# EasyEDA Pro project ProProject_XIAO_NRF52833_2024-01-15.epro, schematic Schematic1
Create Date: 2023-08-24; Page Name: P1; Project Name: XIAO_NRF52833; Schematic Name: Schematic1; Update Date: 2023-10-26; Drawed: Stephen Long Jr; Page Size: A4; Part Number: XIAO833_001; Version: V1.0
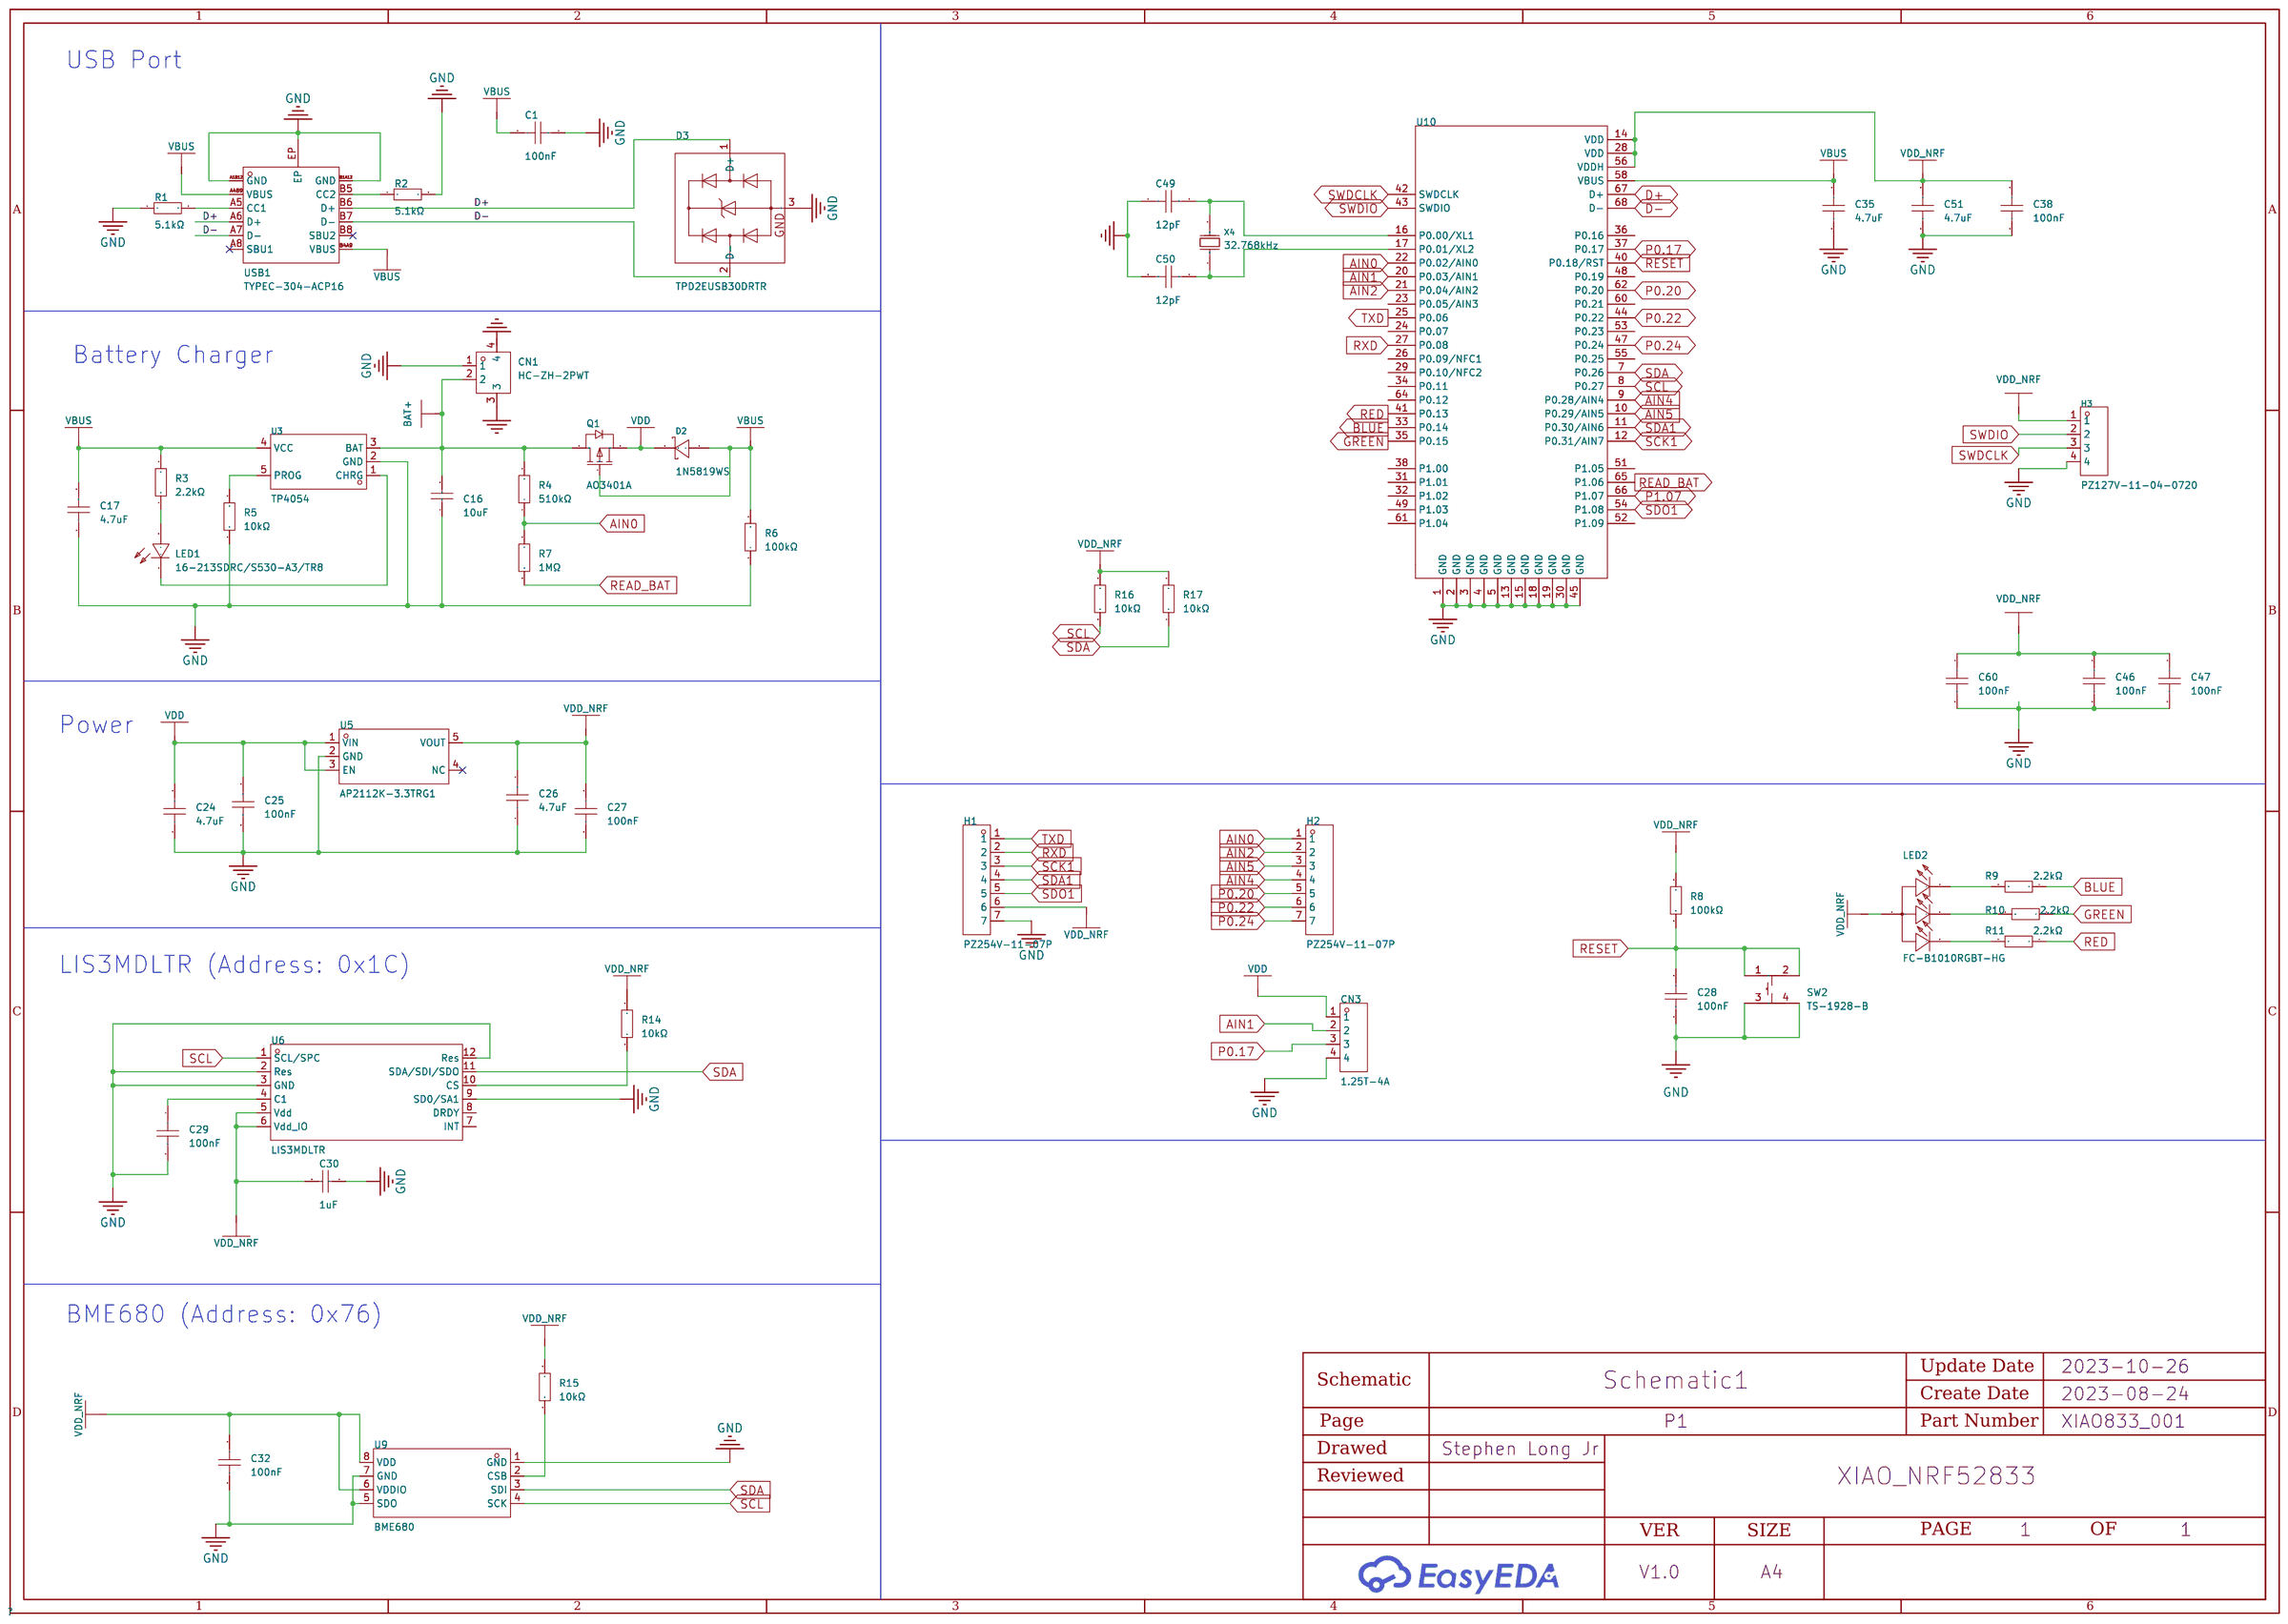
[diagram p1: schematic sheet]

## Parts
C1  100nF  [C0201]
C16  10uF  [C0402]
C17  4.7uF  [C0201]
C24  4.7uF  [C0201]
C25  100nF  [C0201]
C26  4.7uF  [C0201]
C27  100nF  [C0201]
C28  100nF  [C0201]
C29  100nF  [C0201]
C30  1uF  [C0201]
C32  100nF  [C0201]
C35  4.7uF  [C0201]
C38  100nF  [C0201]
C46  100nF  [C0201]
C47  100nF  [C0201]
C49  12pF  [C0201]
C50  12pF  [C0201]
C51  4.7uF  [C0201]
C60  100nF  [C0201]
CN1  HC-ZH-2PWT  [CONN-SMD_2P-P1.50_HCTL_HC-ZH-2PWT]
CN3  1.25T-4A  [CONN-TH_11.25T-4A]
D2  1N5819WS  [SOD-323_L1.8-W1.3-LS2.5-RD]
D3  TPD2EUSB30DRTR  [SOT-9X3-3_L1.0-W0.8-P0.35-LS1.0-BR]
H1  PZ254V-11-07P  [HDR-TH_7P-P2.54-V-M]  (no BOM)
H2  PZ254V-11-07P  [HDR-TH_7P-P2.54-V-M]  (no BOM)
H3  PZ127V-11-04-0720  [HDR-TH_4P-P1.27-V-M]  (no BOM)
LED1  16-213SDRC/S530-A3/TR8  [LED0402-RD]
LED2  FC-B1010RGBT-HG  [LED-ARRAY-SMD_4P-L1.0-W1.0-TR-RD]
Q1  AO3401A  [SOT-23_L2.9-W1.3-P1.90-LS2.4-BR]
R1  5.1kΩ  [R0201]
R2  5.1kΩ  [R0201]
R3  2.2kΩ  [R0201]
R4  510kΩ  [R0201]
R5  10kΩ  [R0201]
R6  100kΩ  [R0201]
R7  1MΩ  [R0201]
R8  100kΩ  [R0201]
R9  2.2kΩ  [R0201]
R10  2.2kΩ  [R0201]
R11  2.2kΩ  [R0201]
R14  10kΩ  [R0201]
R15  10kΩ  [R0201]
R16  10kΩ  [R0201]
R17  10kΩ  [R0201]
SW2  TS-1928-B  [KEY-SMD_4P-L2.8-W2.0-P1.20-LS3.0-TL]
U3  TP4054  [TSOT-23-5_L2.9-W1.6-P0.95-LS2.8-BR]
U5  AP2112K-3.3TRG1  [SOT-25-5_L2.9-W1.6-P0.95-LS2.8-BL]
U6  LIS3MDLTR  [LGA-12_L2.0-W2.0-P0.50-BL]
U9  BME680  [LGA-8_L3.0-W3.0-P0.80-TR]
U10  -  [XCVR_BM833E]
USB1  TYPEC-304-ACP16  [USB-C-SMD_TYPE-C-16P-1]
X4  32.768kHz  [CRYSTAL-SMD_L1.7-W1.1]

## Library data of the parts
C1 C25 C27-C29 C32 C38 C46 C47 C60 = CL03A104KQ3NNNC: Capacitance: Tolerance:±10% Tolerance:±10% Voltage Rated: Temperature Coefficient:; LCSC Part Name: 100nF ±10% 6.3V; Supplier Part: C160831; Manufacturer: SAMSUNG(三星); Supplier Footprint: 0201; JLCPCB Part Class: Extended Part; Datasheet: https://atta.szlcsc.com/upload/public/pdf/source/20171228/C160831_15144412250661213800.pdf; Supplier: LCSC; Tolerance: ±10%
C16 = CL05A106MQ5NUNC: Capacitance: Tolerance:±20% Tolerance:±20% Voltage Rated: Temperature Coefficient:; LCSC Part Name: 10uF ±20% 6.3V; Supplier Part: C15525; Manufacturer: SAMSUNG(三星); Supplier Footprint: 0402; JLCPCB Part Class: Basic Part; Datasheet: https://atta.szlcsc.com/upload/public/pdf/source/20220823/2B02EE04F8F211D38A52DCB16EB6BEBA.pdf; Supplier: LCSC; Tolerance: ±20%
C17 C24 C26 C35 C51 = GRM035R60J475ME15D: Capacitance: Tolerance:±20% Tolerance:±20% Voltage Rated: Temperature Coefficient:; LCSC Part Name: 4.7uF ±20% 6.3V; Supplier Part: C335103; Manufacturer: muRata(村田); Supplier Footprint: 0201; JLCPCB Part Class: Extended Part; Datasheet: https://atta.szlcsc.com/upload/public/pdf/source/20181123/C335103_65BC12EC0C1BBB7D605A3646AEC2CDDD.pdf; Supplier: LCSC; Tolerance: ±20%
C30 = GRM033R60J105KEA2D: Capacitance: Tolerance:±10% Tolerance:±10% Voltage Rated: Temperature Coefficient:; LCSC Part Name: 1uF ±10% 6.3V; Supplier Part: C76929; Manufacturer: muRata(村田); Supplier Footprint: 0201; JLCPCB Part Class: Extended Part; Datasheet: https://atta.szlcsc.com/upload/public/pdf/source/20161024/1477279478095.pdf; Supplier: LCSC; Tolerance: ±10%
C49 C50 = GRM0335C1H120FA01D: Capacitance: Tolerance:±1% Tolerance:±1% Voltage Rated: Temperature Coefficient:; LCSC Part Name: 12pF ±1% 50V; Supplier Part: C384960; Manufacturer: muRata(村田); Supplier Footprint: 0201; JLCPCB Part Class: Extended Part; Datasheet: https://atta.szlcsc.com/upload/public/pdf/source/20200724/C384960_E35DB75AD6D4B3E668DE68A9F604D08E.pdf; Supplier: LCSC; Tolerance: ±1%
CN1 = HC-ZH-2PWT: Reference Series:- Pitch:1.5mm Pins Structure:1x2P Number of Rows:1 Number of PINs Per Row:2 Row Spacing:- Gender:公型插针 Mounting Style:Surface Mount Current Rating (Max):2A Operating Temperature Range:-25℃~+85℃ Operating Temperature Range:-25℃~+85℃; LCSC Part Name: 2P 卧贴 间距P=1.5mm; Supplier Part: C2845424; Manufacturer: HCTL(华灿天禄); Supplier Footprint: SMD,P=1.5mm; JLCPCB Part Class: Extended Part; Datasheet: https://atta.szlcsc.com/upload/public/pdf/source/20210728/C2845424_7B6E44CFC3278823D52F35075130A26B.pdf; Supplier: LCSC; Pitch: 1.5mm; Pins Structure: 1x2P; Number of Rows: 1; Number of PINs Per Row: 2; Gender: 公型插针; Mounting Style: Surface Mount; Current Rating (Max): 2A; Operating Temperature Range: -25℃~+85℃
CN3 = 1.25T-4A_C722638: Reference Series:- Pitch:1.25mm Pins Structure:1x4P Number of Rows:1 Number of PINs Per Row:4 Row Spacing:- Gender:公型插针 Mounting Style:Straight Current Rating (Max):1A Operating Temperature Range:-25℃~+85℃ Operating Temperature Range:-25℃~+85℃; LCSC Part Name: 1.25mm 1x4P 直插; Supplier Part: C722638; Manufacturer: CAX(创都); Supplier Footprint: 直插,P=1.25mm; JLCPCB Part Class: Extended Part; Datasheet: https://atta.szlcsc.com/upload/public/pdf/source/20200831/C722633_AFE288A1881D4EC7ACD8329A0E24959E.pdf; Supplier: LCSC; Pitch: 1.25mm; Pins Structure: 1x4P; Number of Rows: 1; Number of PINs Per Row: 4; Gender: 公型插针; Mounting Style: Straight; Current Rating (Max): 1A; Operating Temperature Range: -25℃~+85℃
D2 = 1N5819WS_C191023: Reverse Voltage (Vr):40V Average Rectified Current (Io):1A Forward Voltage (Vf@If):600mV@1A; LCSC Part Name: 40V 1A 600mV@1A; Supplier Part: C191023; Manufacturer: Hottech(合科泰); Supplier Footprint: SOD-323; JLCPCB Part Class: Basic Part; Datasheet: https://atta.szlcsc.com/upload/public/pdf/source/20220428/3CB86FD8D28D653594B4E35F9D5AEFD9.pdf; Supplier: LCSC; Reverse Voltage (Vr): 40V; Average Rectified Current (Io): 1A; Forward Voltage (Vf@If): 600mV@1A
D3 = TPD2EUSB30DRTR: Polarity:Unidirectional Reverse Stand-Off Voltage (Vrwm):5.5V Breakdown Voltage (VBR):7V Peak Pulse Current(Ipp)@8/20us:1A Clamping Voltage@Ipp:8V Peak Pulse Power(Ppp)@8/20us:45W Junction Capacitance(Cj)@1MHz:- Operating Temperature:-40℃~+85℃@(Ta) Operat; Supplier Part: C97502; Manufacturer: TI(德州仪器); Supplier Footprint: SOT(9x3); JLCPCB Part Class: Extended Part; Datasheet: https://atta.szlcsc.com/upload/public/pdf/source/20180606/C97502_7D6B9DA0047678414AA5A2CAF7AAB465.pdf; Supplier: LCSC; Polarity: Unidirectional; Reverse Stand-Off Voltage (Vrwm): 5.5V; Breakdown Voltage (VBR): 7V; Peak Pulse Current(Ipp)@8/20us: 1A; Clamping Voltage@Ipp: 8V; Peak Pulse Power(Ppp)@8/20us: 45W; Operating Temperature: -40℃~+85℃@(Ta)
H1 H2 = PZ254V-11-07P: Number of Rows:Plugin Number of Pins:7P Pitch:2.54mm Pin Structure:1x7P Row Spacing:- Mounting Type:Straight Circluar Pins/Square Pins:Square Pins Current Rating (Max):- Voltage Rating (Max):- Length of Mating Pin:6mm Insulation Height:2.5mm Length of End; LCSC Part Name: 2.54mm 1x7P 直插 方针; Supplier Part: C492406; Manufacturer: XFCN(兴飞); Supplier Footprint: 插件,P=2.54mm; JLCPCB Part Class: Extended Part; Datasheet: https://atta.szlcsc.com/upload/public/pdf/source/20200309/C492406_654C533EE691117E22DD9F76C114C2D9.pdf; Supplier: LCSC; Number of Rows: Plugin; Number of Pins: 7P; Pitch: 2.54mm; Pin Structure: 1x7P; Mounting Type: Straight; Circluar Pins/Square Pins: Square Pins; Length of Mating Pin: 6mm; Insulation Height: 2.5mm; Length of End Connection Pin: 3mm; Operating Temperature Range: -40℃~+105℃; Color: Black
H3 = PZ127V-11-04-0720: Number of Rows:Plugin Number of Pins:4P Pitch:1.27mm Pin Structure:1x4P Row Spacing:- Mounting Type:Straight Circluar Pins/Square Pins:- Current Rating (Max):- Voltage Rating (Max):- Length of Mating Pin:3.9mm Insulation Height:1mm Length of End Connectio; LCSC Part Name: 1.27mm 1x4P 直插; Supplier Part: C541879; Manufacturer: XFCN(兴飞); Supplier Footprint: 插件,P=1.27mm; JLCPCB Part Class: Extended Part; Datasheet: https://atta.szlcsc.com/upload/public/pdf/source/20200519/C541879_5CD99C402ABEE613587AE88FBA356357.pdf; Supplier: LCSC; Number of Rows: Plugin; Number of Pins: 4P; Pitch: 1.27mm; Pin Structure: 1x4P; Mounting Type: Straight; Length of Mating Pin: 3.9mm; Insulation Height: 1mm; Length of End Connection Pin: 2.3mm; Operating Temperature Range: -40℃~+105℃; Color: Black
LED1 = 16-213SDRC/S530-A3/TR8: Emitted Color:红灯 Lens Color:无色透明 Dominant Wavelength:639nm~639nm Dominant Wavelength:639nm~639nm Peak Wavelength:650nm Forward Current:20mA Forward Voltage (VF):2V Forward Voltage (VF):2V Viewing Angle:120°; LCSC Part Name: 红灯; Supplier Part: C71911; Manufacturer: EVERLIGHT(亿光); Supplier Footprint: 0402; JLCPCB Part Class: Extended Part; Datasheet: https://atta.szlcsc.com/upload/public/pdf/source/20180423/C71911_C51F85E8EEDEC443F292EE02E8E26750.pdf; Supplier: LCSC; Emitted Color: 红灯; Lens Color: 无色透明; Dominant Wavelength: 639nm~639nm; Peak Wavelength: 650nm; Forward Current: 20mA; Forward Voltage (VF): 2V; Viewing Angle: 120°
LED2 = FC-B1010RGBT-HG: Emitted Color:RGB; LCSC Part Name: RGB三色; Supplier Part: C158099; Manufacturer: 国星光电; Supplier Footprint: 0404; JLCPCB Part Class: Extended Part; Datasheet: https://atta.szlcsc.com/upload/public/pdf/source/20200910/C158099_0C805F16310A4C6DB0163E8F613FF382.pdf; Supplier: LCSC; Emitted Color: RGB
Q1 = AO3401A_C347476: Supplier Part: C347476; Manufacturer: UMW(广东友台半导体); Supplier Footprint: SOT-23; JLCPCB Part Class: Extended Part; Datasheet: https://atta.szlcsc.com/upload/public/pdf/source/20190827/C347476_6CCC01FEC3E3D166C83BA0E415FD2056.pdf; Supplier: LCSC
R1 R2 = RC0201FR-075K1L: Type:Thick Film Resistors Resistance: Tolerance:±1% Tolerance:±1% Power(Watts): Temperature Coefficient:±200ppm/℃ Temperature Coefficient:±200ppm/℃ Overload Voltage (Max): Operating Temperature Range:-55℃~+125℃ Operating Temperature Range:-55℃~+125℃; LCSC Part Name: 厚膜电阻 5.1kΩ ±1% 50mW; Supplier Part: C274341; Manufacturer: YAGEO(国巨); Supplier Footprint: 0201; JLCPCB Part Class: Extended Part; Datasheet: https://atta.szlcsc.com/upload/public/pdf/source/20180821/C275644_0D56F95EFF785E7D9A1FEF436B37DA78.pdf; Supplier: LCSC; Type: Thick Film Resistors; Tolerance: ±1%; Temperature Coefficient: ±200ppm/℃; Operating Temperature Range: -55℃~+125℃
R3 R9-R11 = RC0201FR-072K2L: Type:Thick Film Resistors Resistance: Tolerance:±1% Tolerance:±1% Power(Watts): Temperature Coefficient:±200ppm/℃ Temperature Coefficient:±200ppm/℃ Overload Voltage (Max): Operating Temperature Range:-55℃~+125℃ Operating Temperature Range:-55℃~+125℃; LCSC Part Name: 2.2kΩ ±1% 50mW; Supplier Part: C142018; Manufacturer: YAGEO(国巨); Supplier Footprint: 0201; JLCPCB Part Class: Extended Part; Datasheet: https://atta.szlcsc.com/upload/public/pdf/source/20171113/C142018_15105613515531115845.pdf; Supplier: LCSC; Type: Thick Film Resistors; Tolerance: ±1%; Temperature Coefficient: ±200ppm/℃; Operating Temperature Range: -55℃~+125℃
R4 = RC0201FR-07510KL: Type:Thick Film Resistors Resistance: Tolerance:±1% Tolerance:±1% Power(Watts): Temperature Coefficient:±200ppm/℃ Temperature Coefficient:±200ppm/℃ Overload Voltage (Max): Operating Temperature Range:-55℃~+125℃ Operating Temperature Range:-55℃~+125℃; LCSC Part Name: 510kΩ ±1% 50mW; Supplier Part: C295805; Manufacturer: YAGEO(国巨); Supplier Footprint: 0201; JLCPCB Part Class: Extended Part; Datasheet: https://atta.szlcsc.com/upload/public/pdf/source/20180921/C295805_AC1D158A755474E826FD01D881AA929B.pdf; Supplier: LCSC; Type: Thick Film Resistors; Tolerance: ±1%; Temperature Coefficient: ±200ppm/℃; Operating Temperature Range: -55℃~+125℃
R5 R14-R17 = RC0201FR-0710KL: Type:Thick Film Resistors Resistance: Tolerance:±1% Tolerance:±1% Power(Watts): Temperature Coefficient:±200ppm/℃ Temperature Coefficient:±200ppm/℃ Overload Voltage (Max): Operating Temperature Range:-55℃~+125℃ Operating Temperature Range:-55℃~+125℃; LCSC Part Name: 10kΩ ±1% 50mW; Supplier Part: C106225; Manufacturer: YAGEO(国巨); Supplier Footprint: 0201; JLCPCB Part Class: Extended Part; Datasheet: https://atta.szlcsc.com/upload/public/pdf/source/20171221/C106225_15138309973201195185.pdf; Supplier: LCSC; Type: Thick Film Resistors; Tolerance: ±1%; Temperature Coefficient: ±200ppm/℃; Operating Temperature Range: -55℃~+125℃
R6 R8 = RC0201FR-07100KL: Resistance: Tolerance:±1% Tolerance:±1% Power(Watts): Temperature Coefficient:±200ppm/℃ Temperature Coefficient:±200ppm/℃ Overload Voltage (Max): Operating Temperature Range:-55℃~+125℃ Operating Temperature Range:-55℃~+125℃; LCSC Part Name: 100kΩ ±1% 50mW; Supplier Part: C106224; Manufacturer: YAGEO(国巨); Supplier Footprint: 0201; JLCPCB Part Class: Extended Part; Datasheet: https://atta.szlcsc.com/upload/public/pdf/source/20171221/C106224_15138309965451195184.pdf; Supplier: LCSC; Tolerance: ±1%; Temperature Coefficient: ±200ppm/℃; Operating Temperature Range: -55℃~+125℃
R7 = RC0201FR-071ML: Type:Thick Film Resistors Resistance: Tolerance:±1% Tolerance:±1% Power(Watts): Temperature Coefficient:±200ppm/℃ Temperature Coefficient:±200ppm/℃ Overload Voltage (Max): Operating Temperature Range:-55℃~+125℃ Operating Temperature Range:-55℃~+125℃; LCSC Part Name: 1MΩ ±1% 50mW; Supplier Part: C295786; Manufacturer: YAGEO(国巨); Supplier Footprint: 0201; JLCPCB Part Class: Extended Part; Datasheet: https://atta.szlcsc.com/upload/public/pdf/source/20180921/C295786_3F2C1EC02A5F9891A7C118DD4066AFE1.pdf; Supplier: LCSC; Type: Thick Film Resistors; Tolerance: ±1%; Temperature Coefficient: ±200ppm/℃; Operating Temperature Range: -55℃~+125℃
SW2 = TS-1928-B: Contact Current:50mA Voltage Rating (DC):12V Insulation Resistance:- Circuit:SPST Mounting Style:Brick nogging Actuator Style:Round Button Actuator/Cap Color:Black With Lamp:No Operating Force:160gf Mechanical Life:300000次 Operating Temperature:-30℃~+85℃; LCSC Part Name: 立贴 1.95*2.8*0.6mm 轻触开关; Supplier Part: C1121891; Manufacturer: XKB Connectivity(中国星坤); Supplier Footprint: SMD; JLCPCB Part Class: Extended Part; Datasheet: https://atta.szlcsc.com/upload/public/pdf/source/20211011/D4E0D57631292A8298BD84F341C06C74.pdf; Supplier: LCSC; Contact Current: 50mA; Voltage Rating (DC): 12V; Circuit: SPST; Mounting Style: Brick nogging; Actuator Style: Round Button; Actuator/Cap Color: Black; With Lamp: No; Operating Force: 160gf; Mechanical Life: 300000次; Operating Temperature: -30℃~+85℃; Switch Length: 1.95mm; Switch Width: 2.8mm; Switch Height: 0.6mm; Strike Gundam: NO
U3 = TP4054_C668215: Type of Battery:锂离子/Polymer Number of Cells:1 Number of Cells:1 Maximum Charge Current:500mA Supply Voltage:6.5V Supply Voltage:6.5V Operating Temperature:-40℃~+85℃ Operating Temperature:-40℃~+85℃; Supplier Part: C668215; Manufacturer: UMW(友台半导体); Supplier Footprint: SOT-23-5; JLCPCB Part Class: Extended Part; Datasheet: https://atta.szlcsc.com/upload/public/pdf/source/20211011/DD9DB39E30D67DDF115F79B4376A27FF.pdf; Supplier: LCSC; Type of Battery: 锂离子/Polymer; Number of Cells: 1; Maximum Charge Current: 500mA; Supply Voltage: 6.5V; Operating Temperature: -40℃~+85℃
U5 = AP2112K-3.3TRG1: Output Type: Output Polarity:Positive Number of Outputs:1 Maximum Input Voltage:6V Output Voltage:3.3V~3.3V Output Voltage:3.3V~3.3V Dropout Voltage:400mV@(600mA) Output Current:600mA Power Supply Rejection Ratio (PSRR):65dB@(100Hz,1kHz); Supplier Part: C51118; Manufacturer: DIODES(美台); Supplier Footprint: SOT-25-5; JLCPCB Part Class: Extended Part; Datasheet: https://atta.szlcsc.com/upload/public/pdf/source/20171221/C51118_15138312998391195590.pdf; Supplier: LCSC; Output Polarity: Positive; Number of Outputs: 1; Maximum Input Voltage: 6V; Output Voltage: 3.3V~3.3V; Dropout Voltage: 400mV@(600mA); Output Current: 600mA; Power Supply Rejection Ratio (PSRR): 65dB@(100Hz,1kHz)
U6 = LIS3MDLTR: LCSC Part Name: 三轴数字磁传感器; Supplier Part: C478483; Manufacturer: ST(意法半导体); Supplier Footprint: LGA-12; JLCPCB Part Class: Extended Part; Supplier: LCSC
U9 = BME680: Supplier Part: C125972; Manufacturer: Bosch(博世); Supplier Footprint: LGA-8; JLCPCB Part Class: Extended Part; Datasheet: https://atta.szlcsc.com/upload/public/pdf/source/20180327/C125972_A896D04D1D4DD1EE7894A8064AE337BE.pdf; Supplier: LCSC
U10 = BM833E_
USB1 = TYPEC-304-ACP16: Connector Type:Type-C Gender:Female Number of Contacts:16 Number of Ports:1 Mounting Style:Surface Mount Current Rating - Power (Max):3A Operating Temperature Range:-40℃~+85℃ Operating Temperature Range:-40℃~+85℃; LCSC Part Name: Type-C 母座 卧贴; Supplier Part: C2982555; Manufacturer: XUNPU(讯普); Supplier Footprint: SMD; JLCPCB Part Class: Extended Part; Supplier: LCSC; Connector Type: Type-C; Gender: Female; Number of Contacts: 16; Number of Ports: 1; Mounting Style: Surface Mount; Current Rating - Power (Max): 3A; Operating Temperature Range: -40℃~+85℃
X4 = X1A000121000500: Frequency: Frequency Tolerance:- Frequency Tolerance:- Load Capacitance:; LCSC Part Name: 32.768kHz 12.5pF; Supplier Part: C5154201; Manufacturer: EPSON(爱普生); Supplier Footprint: SMD1610-2P; JLCPCB Part Class: Extended Part; Supplier: LCSC

## Nets
GND: C1.1 C16.1 C17.1 C24.1 C25.2 C26.1 C27.2 C28.1 C29.2 C30.2 C32.1 C35.1 C38.2 C46.2 C47.2 C49.1 C50.1 C51.1 C60.2 CN1.1 CN1.3 CN3.4 D3.3(GND) H1.7 H3.4 R1.1 R2.2 R5.1 R6.1 SW2.3 SW2.4 U3.2(GND) U5.2(GND) U6.2(Res) U6.3(GND) U6.9(SD0/SA1) U6.12(Res) U9.1(GND) U9.5(SDO) U9.7(GND) U10.1(GND) U10.2(GND) U10.3(GND) U10.4(GND) U10.5(GND) U10.13(GND) U10.15(GND) U10.18(GND) U10.19(GND) U10.30(GND) U10.45(GND) USB1.A1B12(GND) USB1.B1A12(GND) USB1.EP
VBUS: C1.2 C17.2 C35.2 D2.2(A) Q1.1(G) R3.2 R6.2 U3.4(VCC) U10.58(VBUS) USB1.A4B9(VBUS) USB1.B4A9(VBUS)
VDD: C24.2 C25.1 CN3.1 D2.1(K) Q1.2(S) U5.1(VIN) U5.3(EN)
VDD_NRF: C26.2 C27.1 C30.1 C32.2 C38.1 C46.1 C47.1 C51.2 C60.1 H1.6 H3.1 LED2.1(+) R8.2 R14.2 R15.2 R16.2 R17.2 U5.5(VOUT) U6.5(Vdd) U6.6(Vdd_IO) U9.6(VDDIO) U9.8(VDD) U10.14(VDD) U10.28(VDD) U10.56(VDDH)
AIN0: H2.1 R4.1 R7.1 U10.22(P0.02/AIN0)
AIN1: CN3.2 U10.20(P0.03/AIN1)
AIN2: H2.2 U10.21(P0.04/AIN2)
AIN4: H2.4 U10.9(P0.28/AIN4)
AIN5: H2.3 U10.10(P0.29/AIN5)
BAT+: C16.2 CN1.2 Q1.3(D) R4.2 U3.3(BAT)
BLUE: R9.1 U10.33(P0.14)
D+: D3.1(D+) U10.67(D+) USB1.A6(D+) USB1.B6(D+)
D-: D3.2(D-) U10.68(D-) USB1.A7(D-) USB1.B7(D-)
GREEN: R10.1 U10.35(P0.15)
P0.17: CN3.3 U10.37(P0.17)
P0.20: H2.5 U10.62(P0.20)
P0.22: H2.6 U10.44(P0.22)
P0.24: H2.7 U10.47(P0.24)
P1.07: U10.66(P1.07)
READ_BAT: R7.2 U10.65(P1.06)
RED: R11.1 U10.41(P0.13)
RESET: C28.2 R8.1 SW2.1 SW2.2 U10.40(P0.18/RST)
RXD: H1.2 U10.27(P0.08)
SCK1: H1.3 U10.12(P0.31/AIN7)
SCL: R16.1 U6.1(SCL/SPC) U9.4(SCK) U10.8(P0.27)
SDA: R17.1 U6.11(SDA/SDI/SDO) U9.3(SDI) U10.7(P0.26)
SDA1: H1.4 U10.11(P0.30/AIN6)
SDO1: H1.5 U10.54(P1.08)
SWDCLK: H3.3 U10.42(SWDCLK)
SWDIO: H3.2 U10.43(SWDIO)
TXD: H1.1 U10.25(P0.06)
$1N6010: R1.2 USB1.A5(CC1)
$1N6013: R2.1 USB1.B5(CC2)
$1N6476: R5.2 U3.5(PROG)
$1N7177: R14.1 U6.10(CS)
$1N7737: C29.1 U6.4(C1)
$1N8157: R15.1 U9.2(CSB)
$1N9194: LED2.4(-) R9.2
$1N9197: LED2.3(-) R10.2
$1N9200: LED2.2(-) R11.2
$1N15220: LED1.2(+) R3.1
$1N15223: LED1.1(-) U3.1(CHRG)
$1N34366: C49.2 U10.16(P0.00/XL1) X4.2(OSC2)
$1N34369: C50.2 U10.17(P0.01/XL2) X4.1(OSC1)

Not connected (* = marked no-connect by the designer): CN1 4; U5 4(NC)*; U6 7(INT) 8(DRDY); U10 23(P0.05/AIN3) 24(P0.07) 26(P0.09/NFC1) 29(P0.10/NFC2) 31(P1.01) 32(P1.02) 34(P0.11) 36(P0.16) 38(P1.00) 48(P0.19) 49(P1.03) 51(P1.05) 52(P1.09) 53(P0.23) 55(P0.25) 60(P0.21) 61(P1.04) 64(P0.12); USB1 A8(SBU1)* B8(SBU2)*

## Notes on the sheet
- USB Port
- Battery Charger
- Power
- LIS3MDLTR (Address: 0x1C)
- BME680 (Address: 0x76)
